# Altium schematic sheet pwm_driver.SchDoc
size A3; DocumentNumber: 2; SheetNumber: 2; SheetTotal: 4
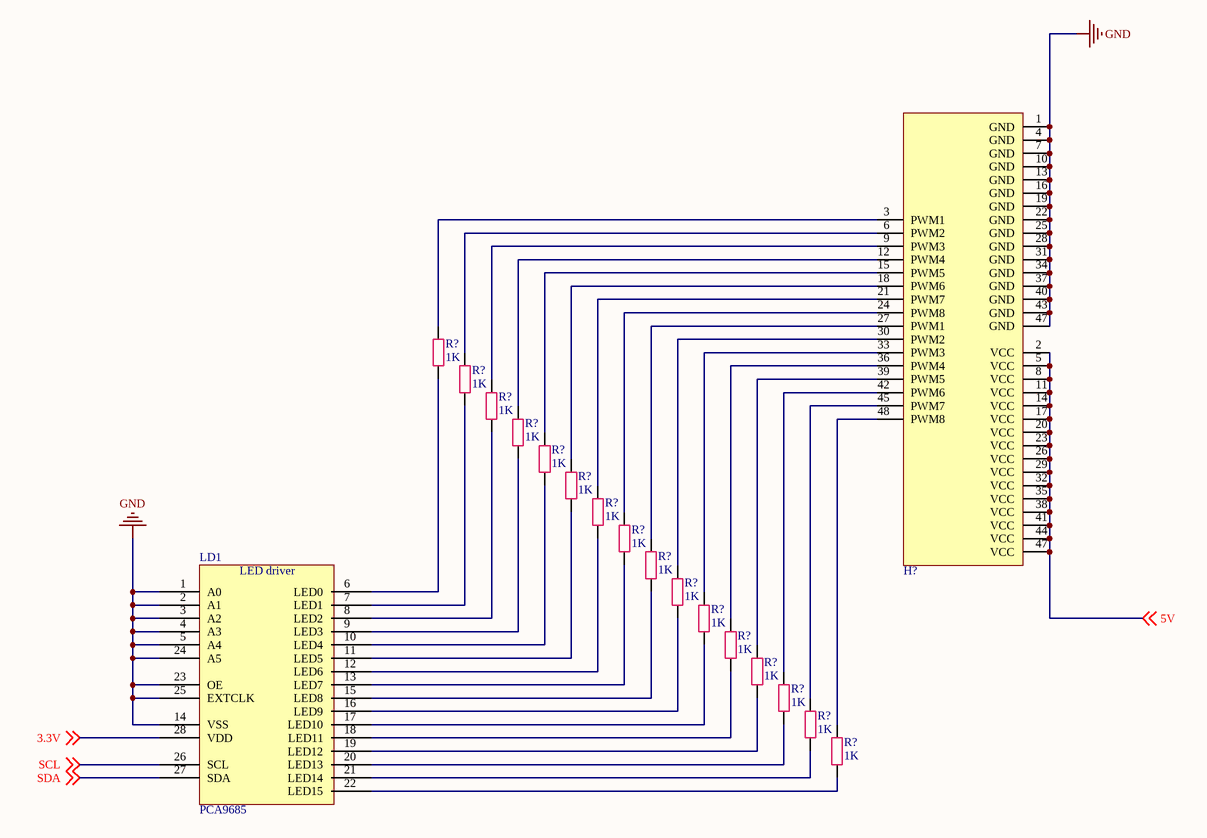
[diagram p0: pwm_driver.SchDoc]

## Parts
(Parts that share a designator on the sheet are numbered #1, #2 ... from top to bottom, then left to right.)
H?  PWM Header  [PWM_HEADER16]  (value not drawn)
LD1  PCA9685  [TSOP65P640X110-28N]
R?#1  value 1K  [R0402]  (hidden comment: Resistor)
R?#2  value 1K  [R0402]  (hidden comment: Resistor)
R?#3  value 1K  [R0402]  (hidden comment: Resistor)
R?#4  value 1K  [R0402]  (hidden comment: Resistor)
R?#5  value 1K  [R0402]  (hidden comment: Resistor)
R?#6  value 1K  [R0402]  (hidden comment: Resistor)
R?#7  value 1K  [R0402]  (hidden comment: Resistor)
R?#8  value 1K  [R0402]  (hidden comment: Resistor)
R?#9  value 1K  [R0402]  (hidden comment: Resistor)
R?#10  value 1K  [R0402]  (hidden comment: Resistor)
R?#11  value 1K  [R0402]  (hidden comment: Resistor)
R?#12  value 1K  [R0402]  (hidden comment: Resistor)
R?#13  value 1K  [R0402]  (hidden comment: Resistor)
R?#14  value 1K  [R0402]  (hidden comment: Resistor)
R?#15  value 1K  [R0402]  (hidden comment: Resistor)
R?#16  value 1K  [R0402]  (hidden comment: Resistor)

## Nets
GND: H?.1(GND) H?.4(GND) H?.7(GND) H?.10(GND) H?.13(GND) H?.16(GND) H?.19(GND) H?.22(GND) H?.25(GND) H?.28(GND) H?.31(GND) H?.34(GND) H?.37(GND) H?.40(GND) H?.43(GND) H?.47(GND) LD1.1(A0) LD1.2(A1) LD1.3(A2) LD1.4(A3) LD1.5(A4) LD1.14(VSS) LD1.23(OE) LD1.24(A5) LD1.25(EXTCLK)
3.3V: LD1.28(VDD) ; off-sheet 3.3V
5V: H?.2(VCC) H?.5(VCC) H?.8(VCC) H?.11(VCC) H?.14(VCC) H?.17(VCC) H?.20(VCC) H?.23(VCC) H?.26(VCC) H?.29(VCC) H?.32(VCC) H?.35(VCC) H?.38(VCC) H?.41(VCC) H?.44(VCC) H?.47(VCC) ; off-sheet 5V
SCL: LD1.26(SCL) ; off-sheet SCL
SDA: LD1.27(SDA) ; off-sheet SDA
NetH?_3: H?.3(PWM1) R?#1.2
NetH?_6: H?.6(PWM2) R?#2.2
NetH?_9: H?.9(PWM3) R?#3.2
NetH?_12: H?.12(PWM4) R?#4.2
NetH?_15: H?.15(PWM5) R?#5.2
NetH?_18: H?.18(PWM6) R?#6.2
NetH?_21: H?.21(PWM7) R?#7.2
NetH?_24: H?.24(PWM8) R?#8.2
NetH?_27: H?.27(PWM1) R?#9.2
NetH?_30: H?.30(PWM2) R?#10.2
NetH?_33: H?.33(PWM3) R?#11.2
NetH?_36: H?.36(PWM4) R?#12.2
NetH?_39: H?.39(PWM5) R?#13.2
NetH?_42: H?.42(PWM6) R?#14.2
NetH?_45: H?.45(PWM7) R?#15.2
NetH?_48: H?.48(PWM8) R?#16.2
NetLD1_6: LD1.6(LED0) R?#1.1
NetLD1_7: LD1.7(LED1) R?#2.1
NetLD1_8: LD1.8(LED2) R?#3.1
NetLD1_9: LD1.9(LED3) R?#4.1
NetLD1_10: LD1.10(LED4) R?#5.1
NetLD1_11: LD1.11(LED5) R?#6.1
NetLD1_12: LD1.12(LED6) R?#7.1
NetLD1_13: LD1.13(LED7) R?#8.1
NetLD1_15: LD1.15(LED8) R?#9.1
NetLD1_16: LD1.16(LED9) R?#10.1
NetLD1_17: LD1.17(LED10) R?#11.1
NetLD1_18: LD1.18(LED11) R?#12.1
NetLD1_19: LD1.19(LED12) R?#13.1
NetLD1_20: LD1.20(LED13) R?#14.1
NetLD1_21: LD1.21(LED14) R?#15.1
NetLD1_22: LD1.22(LED15) R?#16.1

## Notes on the sheet
- (in symbol PCA9685) LED driver

## Library data of the parts
H? = PWM Header: 16 channel PWM output header